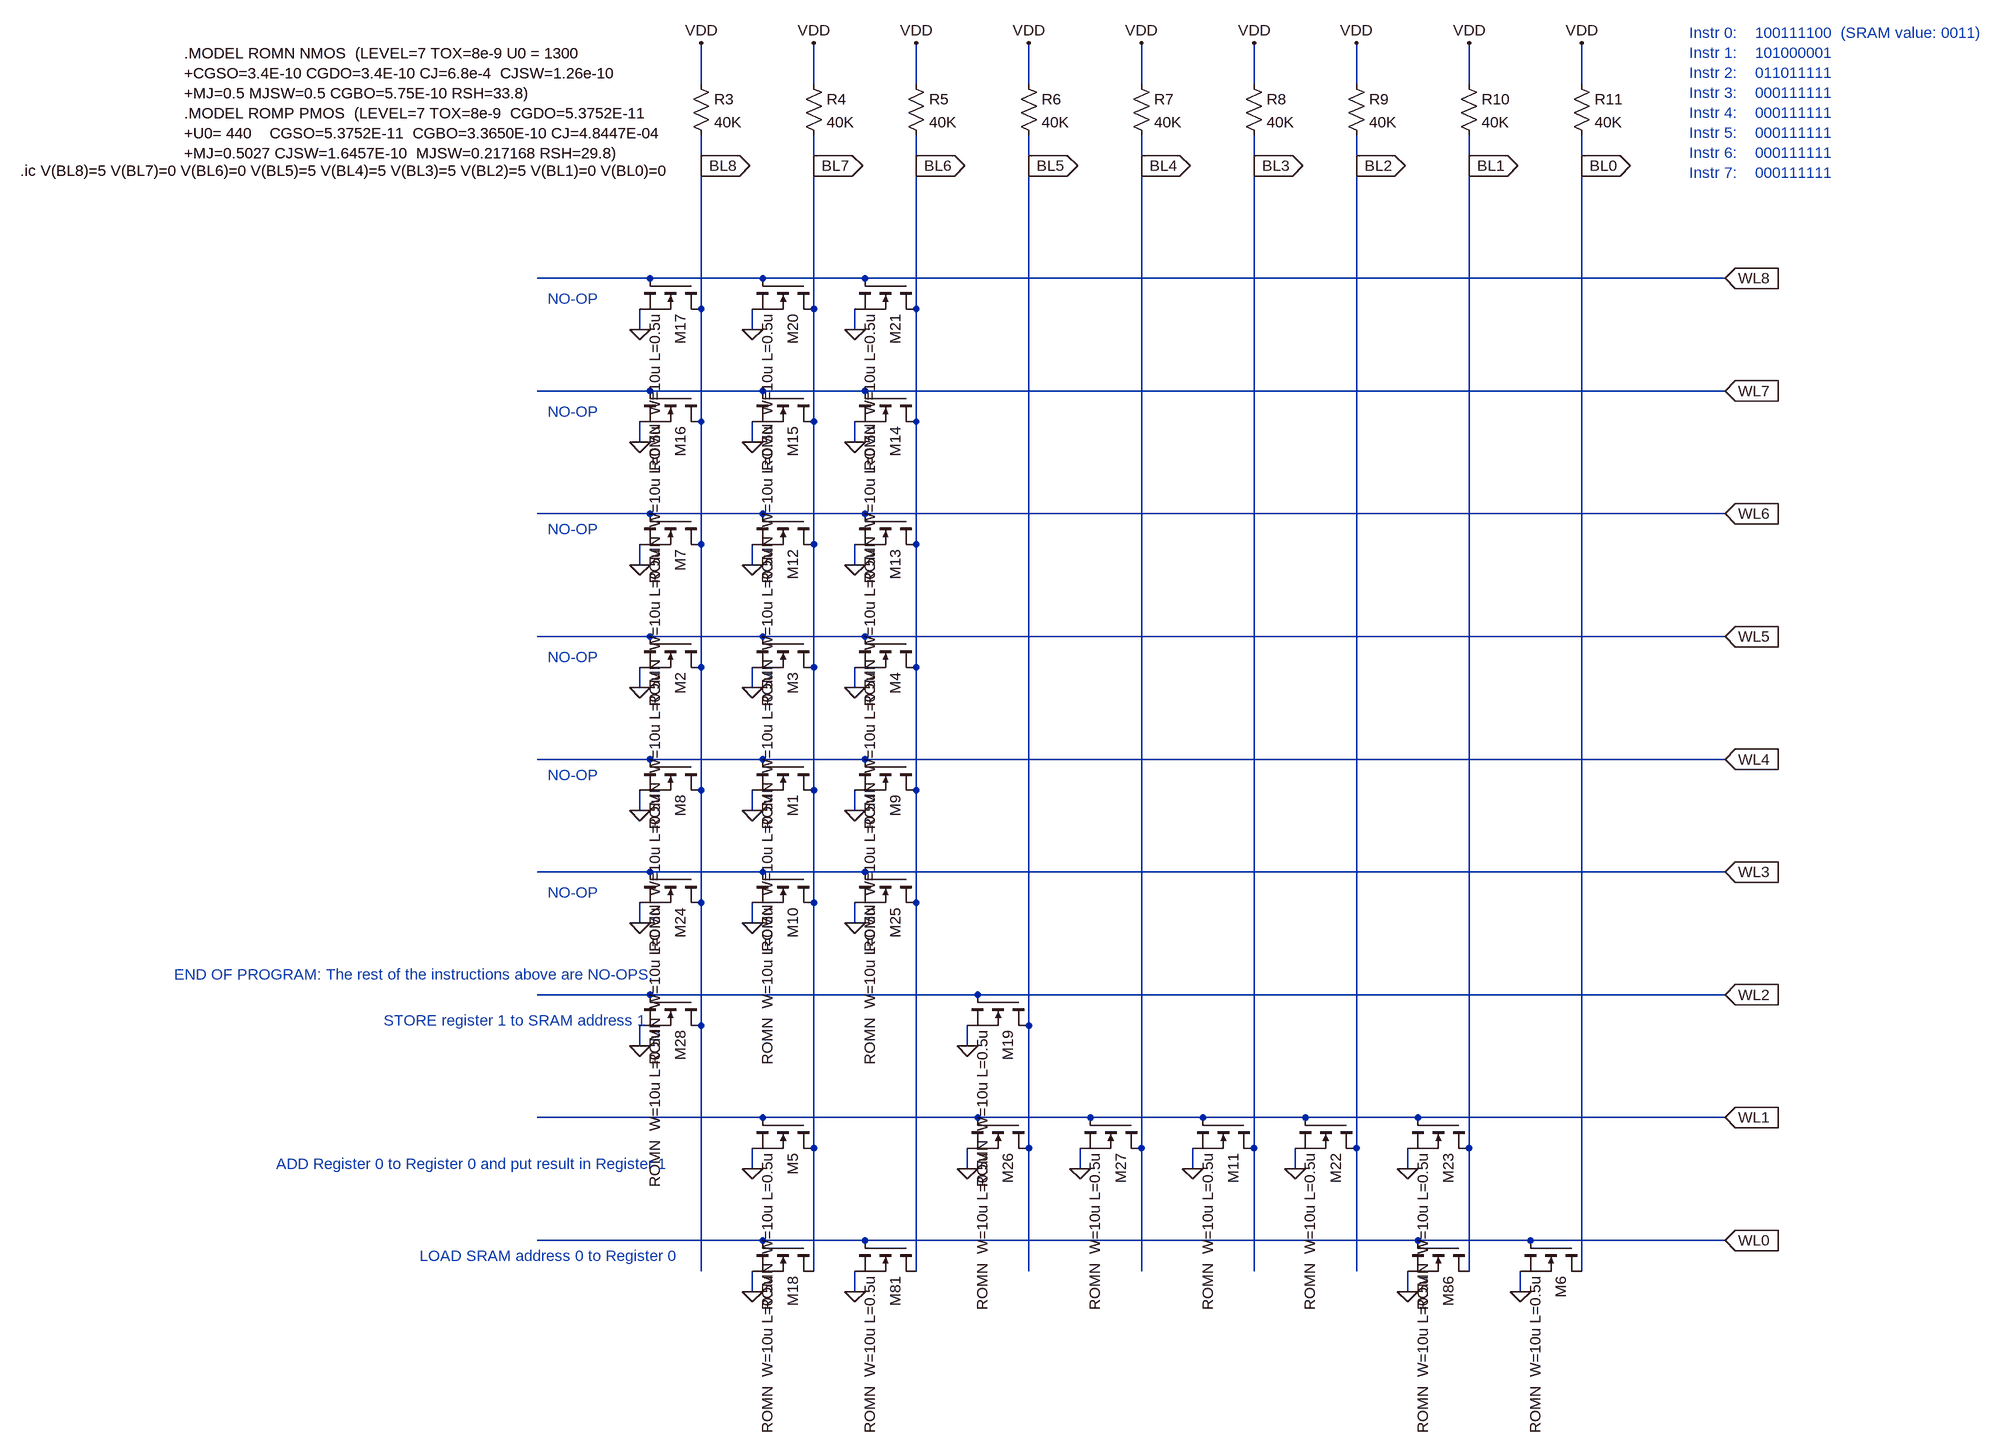
[diagram p0: schematic InstructionMemorySimple.asc]
InstructionMemorySimple.asc, the LTspice schematic file:
Version 4
SHEET 1 2308 1664
WIRE 304 -448 304 -512
WIRE 480 -448 480 -512
WIRE 640 -448 640 -512
WIRE 816 -448 816 -512
WIRE 992 -448 992 -512
WIRE 1168 -448 1168 -512
WIRE 1328 -448 1328 -512
WIRE 1504 -448 1504 -512
WIRE 1680 -448 1680 -512
WIRE 304 -320 304 -368
WIRE 480 -320 480 -368
WIRE 640 -320 640 -368
WIRE 816 -320 816 -368
WIRE 992 -320 992 -368
WIRE 1168 -320 1168 -368
WIRE 1328 -320 1328 -368
WIRE 1504 -320 1504 -368
WIRE 1680 -320 1680 -368
WIRE 224 -144 48 -144
WIRE 400 -144 224 -144
WIRE 560 -144 400 -144
WIRE 1904 -144 560 -144
WIRE 304 -96 304 -320
WIRE 480 -96 480 -320
WIRE 640 -96 640 -320
WIRE 208 -64 208 -96
WIRE 384 -64 384 -96
WIRE 544 -64 544 -96
WIRE 224 32 48 32
WIRE 400 32 224 32
WIRE 560 32 400 32
WIRE 1904 32 560 32
WIRE 304 80 304 -96
WIRE 480 80 480 -96
WIRE 640 80 640 -96
WIRE 208 112 208 80
WIRE 384 112 384 80
WIRE 544 112 544 80
WIRE 224 224 48 224
WIRE 400 224 224 224
WIRE 560 224 400 224
WIRE 1904 224 560 224
WIRE 304 272 304 80
WIRE 480 272 480 80
WIRE 640 272 640 80
WIRE 208 304 208 272
WIRE 384 304 384 272
WIRE 544 304 544 272
WIRE 224 416 48 416
WIRE 400 416 224 416
WIRE 560 416 400 416
WIRE 1904 416 560 416
WIRE 304 464 304 272
WIRE 480 464 480 272
WIRE 640 464 640 272
WIRE 208 496 208 464
WIRE 384 496 384 464
WIRE 544 496 544 464
WIRE 224 608 48 608
WIRE 400 608 224 608
WIRE 560 608 400 608
WIRE 1904 608 560 608
WIRE 304 656 304 464
WIRE 480 656 480 464
WIRE 640 656 640 464
WIRE 208 688 208 656
WIRE 384 688 384 656
WIRE 544 688 544 656
WIRE 224 784 48 784
WIRE 400 784 224 784
WIRE 560 784 400 784
WIRE 1904 784 560 784
WIRE 304 832 304 656
WIRE 480 832 480 656
WIRE 640 832 640 656
WIRE 208 864 208 832
WIRE 384 864 384 832
WIRE 544 864 544 832
WIRE 224 976 48 976
WIRE 736 976 224 976
WIRE 1904 976 736 976
WIRE 304 1024 304 832
WIRE 816 1024 816 -320
WIRE 208 1056 208 1024
WIRE 720 1056 720 1024
WIRE 400 1168 48 1168
WIRE 736 1168 400 1168
WIRE 912 1168 736 1168
WIRE 1088 1168 912 1168
WIRE 1248 1168 1088 1168
WIRE 1424 1168 1248 1168
WIRE 1904 1168 1424 1168
WIRE 480 1216 480 832
WIRE 816 1216 816 1024
WIRE 992 1216 992 -320
WIRE 1168 1216 1168 -320
WIRE 1328 1216 1328 -320
WIRE 1504 1216 1504 -320
WIRE 384 1248 384 1216
WIRE 720 1248 720 1216
WIRE 896 1248 896 1216
WIRE 1072 1248 1072 1216
WIRE 1232 1248 1232 1216
WIRE 1408 1248 1408 1216
WIRE 400 1360 48 1360
WIRE 560 1360 400 1360
WIRE 1424 1360 560 1360
WIRE 1600 1360 1424 1360
WIRE 1904 1360 1600 1360
WIRE 304 1408 304 1024
WIRE 480 1408 480 1216
WIRE 640 1408 640 832
WIRE 816 1408 816 1216
WIRE 992 1408 992 1216
WIRE 1168 1408 1168 1216
WIRE 1328 1408 1328 1216
WIRE 1504 1408 1504 1216
WIRE 1680 1408 1680 -320
WIRE 384 1440 384 1408
WIRE 544 1440 544 1408
WIRE 1408 1440 1408 1408
WIRE 1584 1440 1584 1408
FLAG 304 -512 VDD
FLAG 480 -512 VDD
FLAG 640 -512 VDD
FLAG 816 -512 VDD
FLAG 992 -512 VDD
FLAG 1168 -512 VDD
FLAG 1328 -512 VDD
FLAG 1504 -512 VDD
FLAG 1680 -512 VDD
FLAG 1904 32 WL7
IOPIN 1904 32 In
FLAG 1904 224 WL6
IOPIN 1904 224 In
FLAG 1904 416 WL5
IOPIN 1904 416 In
FLAG 1904 608 WL4
IOPIN 1904 608 In
FLAG 1904 784 WL3
IOPIN 1904 784 In
FLAG 1904 976 WL2
IOPIN 1904 976 In
FLAG 1904 1168 WL1
IOPIN 1904 1168 In
FLAG 1904 1360 WL0
IOPIN 1904 1360 In
FLAG 544 1440 0
FLAG 1408 1440 0
FLAG 304 -320 BL8
IOPIN 304 -320 Out
FLAG 480 -320 BL7
IOPIN 480 -320 Out
FLAG 640 -320 BL6
IOPIN 640 -320 Out
FLAG 816 -320 BL5
IOPIN 816 -320 Out
FLAG 992 -320 BL4
IOPIN 992 -320 Out
FLAG 1168 -320 BL3
IOPIN 1168 -320 Out
FLAG 1328 -320 BL2
IOPIN 1328 -320 Out
FLAG 1504 -320 BL1
IOPIN 1504 -320 Out
FLAG 1680 -320 BL0
IOPIN 1680 -320 Out
FLAG 384 1248 0
FLAG 1584 1440 0
FLAG 384 1440 0
FLAG 720 1056 0
FLAG 384 688 0
FLAG 208 688 0
FLAG 544 688 0
FLAG 384 864 0
FLAG 208 864 0
FLAG 544 864 0
FLAG 1072 1248 0
FLAG 1232 1248 0
FLAG 1408 1248 0
FLAG 720 1248 0
FLAG 896 1248 0
FLAG 208 1056 0
FLAG 1904 -144 WL8
IOPIN 1904 -144 In
FLAG 208 496 0
FLAG 384 496 0
FLAG 544 496 0
FLAG 208 304 0
FLAG 384 304 0
FLAG 544 304 0
FLAG 544 112 0
FLAG 384 112 0
FLAG 208 112 0
FLAG 208 -64 0
FLAG 384 -64 0
FLAG 544 -64 0
SYMBOL res 288 -464 R0
SYMATTR InstName R3
SYMATTR Value 40K
SYMBOL res 464 -464 R0
SYMATTR InstName R4
SYMATTR Value 40K
SYMBOL res 624 -464 R0
SYMATTR InstName R5
SYMATTR Value 40K
SYMBOL res 800 -464 R0
SYMATTR InstName R6
SYMATTR Value 40K
SYMBOL res 976 -464 R0
SYMATTR InstName R7
SYMATTR Value 40K
SYMBOL res 1152 -464 R0
SYMATTR InstName R8
SYMATTR Value 40K
SYMBOL res 1312 -464 R0
SYMATTR InstName R9
SYMATTR Value 40K
SYMBOL res 1488 -464 R0
SYMATTR InstName R10
SYMATTR Value 40K
SYMBOL res 1664 -464 R0
SYMATTR InstName R11
SYMATTR Value 40K
SYMBOL nmos 640 1360 R90
SYMATTR InstName M81
SYMATTR Value ROMN  W=10u L=0.5u
SYMBOL nmos 1504 1360 R90
SYMATTR InstName M86
SYMATTR Value ROMN  W=10u L=0.5u
SYMBOL nmos 480 1168 R90
SYMATTR InstName M5
SYMATTR Value ROMN  W=10u L=0.5u
SYMBOL nmos 1680 1360 R90
SYMATTR InstName M6
SYMATTR Value ROMN  W=10u L=0.5u
SYMBOL nmos 480 1360 R90
SYMATTR InstName M18
SYMATTR Value ROMN  W=10u L=0.5u
SYMBOL nmos 816 976 R90
SYMATTR InstName M19
SYMATTR Value ROMN  W=10u L=0.5u
SYMBOL nmos 480 608 R90
SYMATTR InstName M1
SYMATTR Value ROMN  W=10u L=0.5u
SYMBOL nmos 304 608 R90
SYMATTR InstName M8
SYMATTR Value ROMN  W=10u L=0.5u
SYMBOL nmos 640 608 R90
SYMATTR InstName M9
SYMATTR Value ROMN  W=10u L=0.5u
SYMBOL nmos 480 784 R90
SYMATTR InstName M10
SYMATTR Value ROMN  W=10u L=0.5u
SYMBOL nmos 304 784 R90
SYMATTR InstName M24
SYMATTR Value ROMN  W=10u L=0.5u
SYMBOL nmos 640 784 R90
SYMATTR InstName M25
SYMATTR Value ROMN  W=10u L=0.5u
SYMBOL nmos 1168 1168 R90
SYMATTR InstName M11
SYMATTR Value ROMN  W=10u L=0.5u
SYMBOL nmos 1328 1168 R90
SYMATTR InstName M22
SYMATTR Value ROMN  W=10u L=0.5u
SYMBOL nmos 1504 1168 R90
SYMATTR InstName M23
SYMATTR Value ROMN  W=10u L=0.5u
SYMBOL nmos 816 1168 R90
SYMATTR InstName M26
SYMATTR Value ROMN  W=10u L=0.5u
SYMBOL nmos 992 1168 R90
SYMATTR InstName M27
SYMATTR Value ROMN  W=10u L=0.5u
SYMBOL nmos 304 976 R90
SYMATTR InstName M28
SYMATTR Value ROMN  W=10u L=0.5u
SYMBOL nmos 304 416 R90
SYMATTR InstName M2
SYMATTR Value ROMN  W=10u L=0.5u
SYMBOL nmos 480 416 R90
SYMATTR InstName M3
SYMATTR Value ROMN  W=10u L=0.5u
SYMBOL nmos 640 416 R90
SYMATTR InstName M4
SYMATTR Value ROMN  W=10u L=0.5u
SYMBOL nmos 304 224 R90
SYMATTR InstName M7
SYMATTR Value ROMN  W=10u L=0.5u
SYMBOL nmos 480 224 R90
SYMATTR InstName M12
SYMATTR Value ROMN  W=10u L=0.5u
SYMBOL nmos 640 224 R90
SYMATTR InstName M13
SYMATTR Value ROMN  W=10u L=0.5u
SYMBOL nmos 640 32 R90
SYMATTR InstName M14
SYMATTR Value ROMN  W=10u L=0.5u
SYMBOL nmos 480 32 R90
SYMATTR InstName M15
SYMATTR Value ROMN  W=10u L=0.5u
SYMBOL nmos 304 32 R90
SYMATTR InstName M16
SYMATTR Value ROMN  W=10u L=0.5u
SYMBOL nmos 304 -144 R90
SYMATTR InstName M17
SYMATTR Value ROMN  W=10u L=0.5u
SYMBOL nmos 480 -144 R90
SYMATTR InstName M20
SYMATTR Value ROMN  W=10u L=0.5u
SYMBOL nmos 640 -144 R90
SYMATTR InstName M21
SYMATTR Value ROMN  W=10u L=0.5u
TEXT 1848 -528 Left 2 ;Instr 0:    100111100  (SRAM value: 0011)\nInstr 1:    101000001  \nInstr 2:    011011111\nInstr 3:    000111111\nInstr 4:    000111111\nInstr 5:    000111111\nInstr 6:    000111111\nInstr 7:    000111111
TEXT 64 64 Left 2 ;NO-OP
TEXT 64 248 Left 2 ;NO-OP
TEXT 64 448 Left 2 ;NO-OP
TEXT -136 1384 Left 2 ;LOAD SRAM address 0 to Register 0
TEXT -192 1016 Left 2 ;STORE register 1 to SRAM address 1
TEXT -520 944 Left 2 ;END OF PROGRAM: The rest of the instructions above are NO-OPS.
TEXT -360 1240 Left 2 ;ADD Register 0 to Register 0 and put result in Register 1
TEXT 64 632 Left 2 ;NO-OP
TEXT 64 816 Left 2 ;NO-OP
TEXT -504 -496 Left 2 !.MODEL ROMN NMOS  (LEVEL=7 TOX=8e-9 U0 = 1300\n+CGSO=3.4E-10 CGDO=3.4E-10 CJ=6.8e-4  CJSW=1.26e-10\n+MJ=0.5 MJSW=0.5 CGBO=5.75E-10 RSH=33.8)\n.MODEL ROMP PMOS  (LEVEL=7 TOX=8e-9  CGDO=5.3752E-11\n+U0= 440    CGSO=5.3752E-11  CGBO=3.3650E-10 CJ=4.8447E-04\n+MJ=0.5027 CJSW=1.6457E-10  MJSW=0.217168 RSH=29.8)
TEXT -760 -312 Left 2 !.ic V(BL8)=5 V(BL7)=0 V(BL6)=0 V(BL5)=5 V(BL4)=5 V(BL3)=5 V(BL2)=5 V(BL1)=0 V(BL0)=0
TEXT 64 -112 Left 2 ;NO-OP

The netlist it stands for:
* InstructionMemorySimple.asc
R3 VDD BL8 40K
R4 VDD BL7 40K
R5 VDD BL6 40K
R6 VDD BL5 40K
R7 VDD BL4 40K
R8 VDD BL3 40K
R9 VDD BL2 40K
R10 VDD BL1 40K
R11 VDD BL0 40K
M81 BL6 WL0 0 0 ROMN  W=10u L=0.5u
M86 BL1 WL0 0 0 ROMN  W=10u L=0.5u
M5 BL7 WL1 0 0 ROMN  W=10u L=0.5u
M6 BL0 WL0 0 0 ROMN  W=10u L=0.5u
M18 BL7 WL0 0 0 ROMN  W=10u L=0.5u
M19 BL5 WL2 0 0 ROMN  W=10u L=0.5u
M1 BL7 WL4 0 0 ROMN  W=10u L=0.5u
M8 BL8 WL4 0 0 ROMN  W=10u L=0.5u
M9 BL6 WL4 0 0 ROMN  W=10u L=0.5u
M10 BL7 WL3 0 0 ROMN  W=10u L=0.5u
M24 BL8 WL3 0 0 ROMN  W=10u L=0.5u
M25 BL6 WL3 0 0 ROMN  W=10u L=0.5u
M11 BL3 WL1 0 0 ROMN  W=10u L=0.5u
M22 BL2 WL1 0 0 ROMN  W=10u L=0.5u
M23 BL1 WL1 0 0 ROMN  W=10u L=0.5u
M26 BL5 WL1 0 0 ROMN  W=10u L=0.5u
M27 BL4 WL1 0 0 ROMN  W=10u L=0.5u
M28 BL8 WL2 0 0 ROMN  W=10u L=0.5u
M2 BL8 WL5 0 0 ROMN  W=10u L=0.5u
M3 BL7 WL5 0 0 ROMN  W=10u L=0.5u
M4 BL6 WL5 0 0 ROMN  W=10u L=0.5u
M7 BL8 WL6 0 0 ROMN  W=10u L=0.5u
M12 BL7 WL6 0 0 ROMN  W=10u L=0.5u
M13 BL6 WL6 0 0 ROMN  W=10u L=0.5u
M14 BL6 WL7 0 0 ROMN  W=10u L=0.5u
M15 BL7 WL7 0 0 ROMN  W=10u L=0.5u
M16 BL8 WL7 0 0 ROMN  W=10u L=0.5u
M17 BL8 WL8 0 0 ROMN  W=10u L=0.5u
M20 BL7 WL8 0 0 ROMN  W=10u L=0.5u
M21 BL6 WL8 0 0 ROMN  W=10u L=0.5u
.model NMOS NMOS
.model PMOS PMOS
.lib standard.mos
* Instr 0:    100111100  (SRAM value: 0011)
* Instr 1:    101000001
* Instr 2:    011011111
* Instr 3:    000111111
* Instr 4:    000111111
* Instr 5:    000111111
* Instr 6:    000111111
* Instr 7:    000111111
* NO-OP
* NO-OP
* NO-OP
* LOAD SRAM address 0 to Register 0
* STORE register 1 to SRAM address 1
* END OF PROGRAM: The rest of the instructions above are NO-OPS.
* ADD Register 0 to Register 0 and put result in Register 1
* NO-OP
* NO-OP
.MODEL ROMN NMOS  (LEVEL=7 TOX=8e-9 U0 = 1300
+CGSO=3.4E-10 CGDO=3.4E-10 CJ=6.8e-4  CJSW=1.26e-10
+MJ=0.5 MJSW=0.5 CGBO=5.75E-10 RSH=33.8)
.MODEL ROMP PMOS  (LEVEL=7 TOX=8e-9  CGDO=5.3752E-11
+U0= 440    CGSO=5.3752E-11  CGBO=3.3650E-10 CJ=4.8447E-04
+MJ=0.5027 CJSW=1.6457E-10  MJSW=0.217168 RSH=29.8)
.ic V(BL8)=5 V(BL7)=0 V(BL6)=0 V(BL5)=5 V(BL4)=5 V(BL3)=5 V(BL2)=5 V(BL1)=0 V(BL0)=0
* NO-OP
.backanno
.end